# Altium schematic sheet RK3576-SMC.EMMC (0021.0 A0).SchDoc
size 420 x 297 mm; Scale: -; DocumentType: Схема электрическая принципиальная; DocumentGOSTLIt1: ㅤ; DocumentGOSTLIt2: ㅤ; DocumentGOSTLIt3: ㅤ; DocumentGOSTNote: Элементы, отмеченные *, используются при трассировке печатной платы, в состав модуля не включаются; SheetNumber: 4; SheetTotal: 4; DocumentTypeShort: Э3; DocumentInvertoryNumber: ㅤ
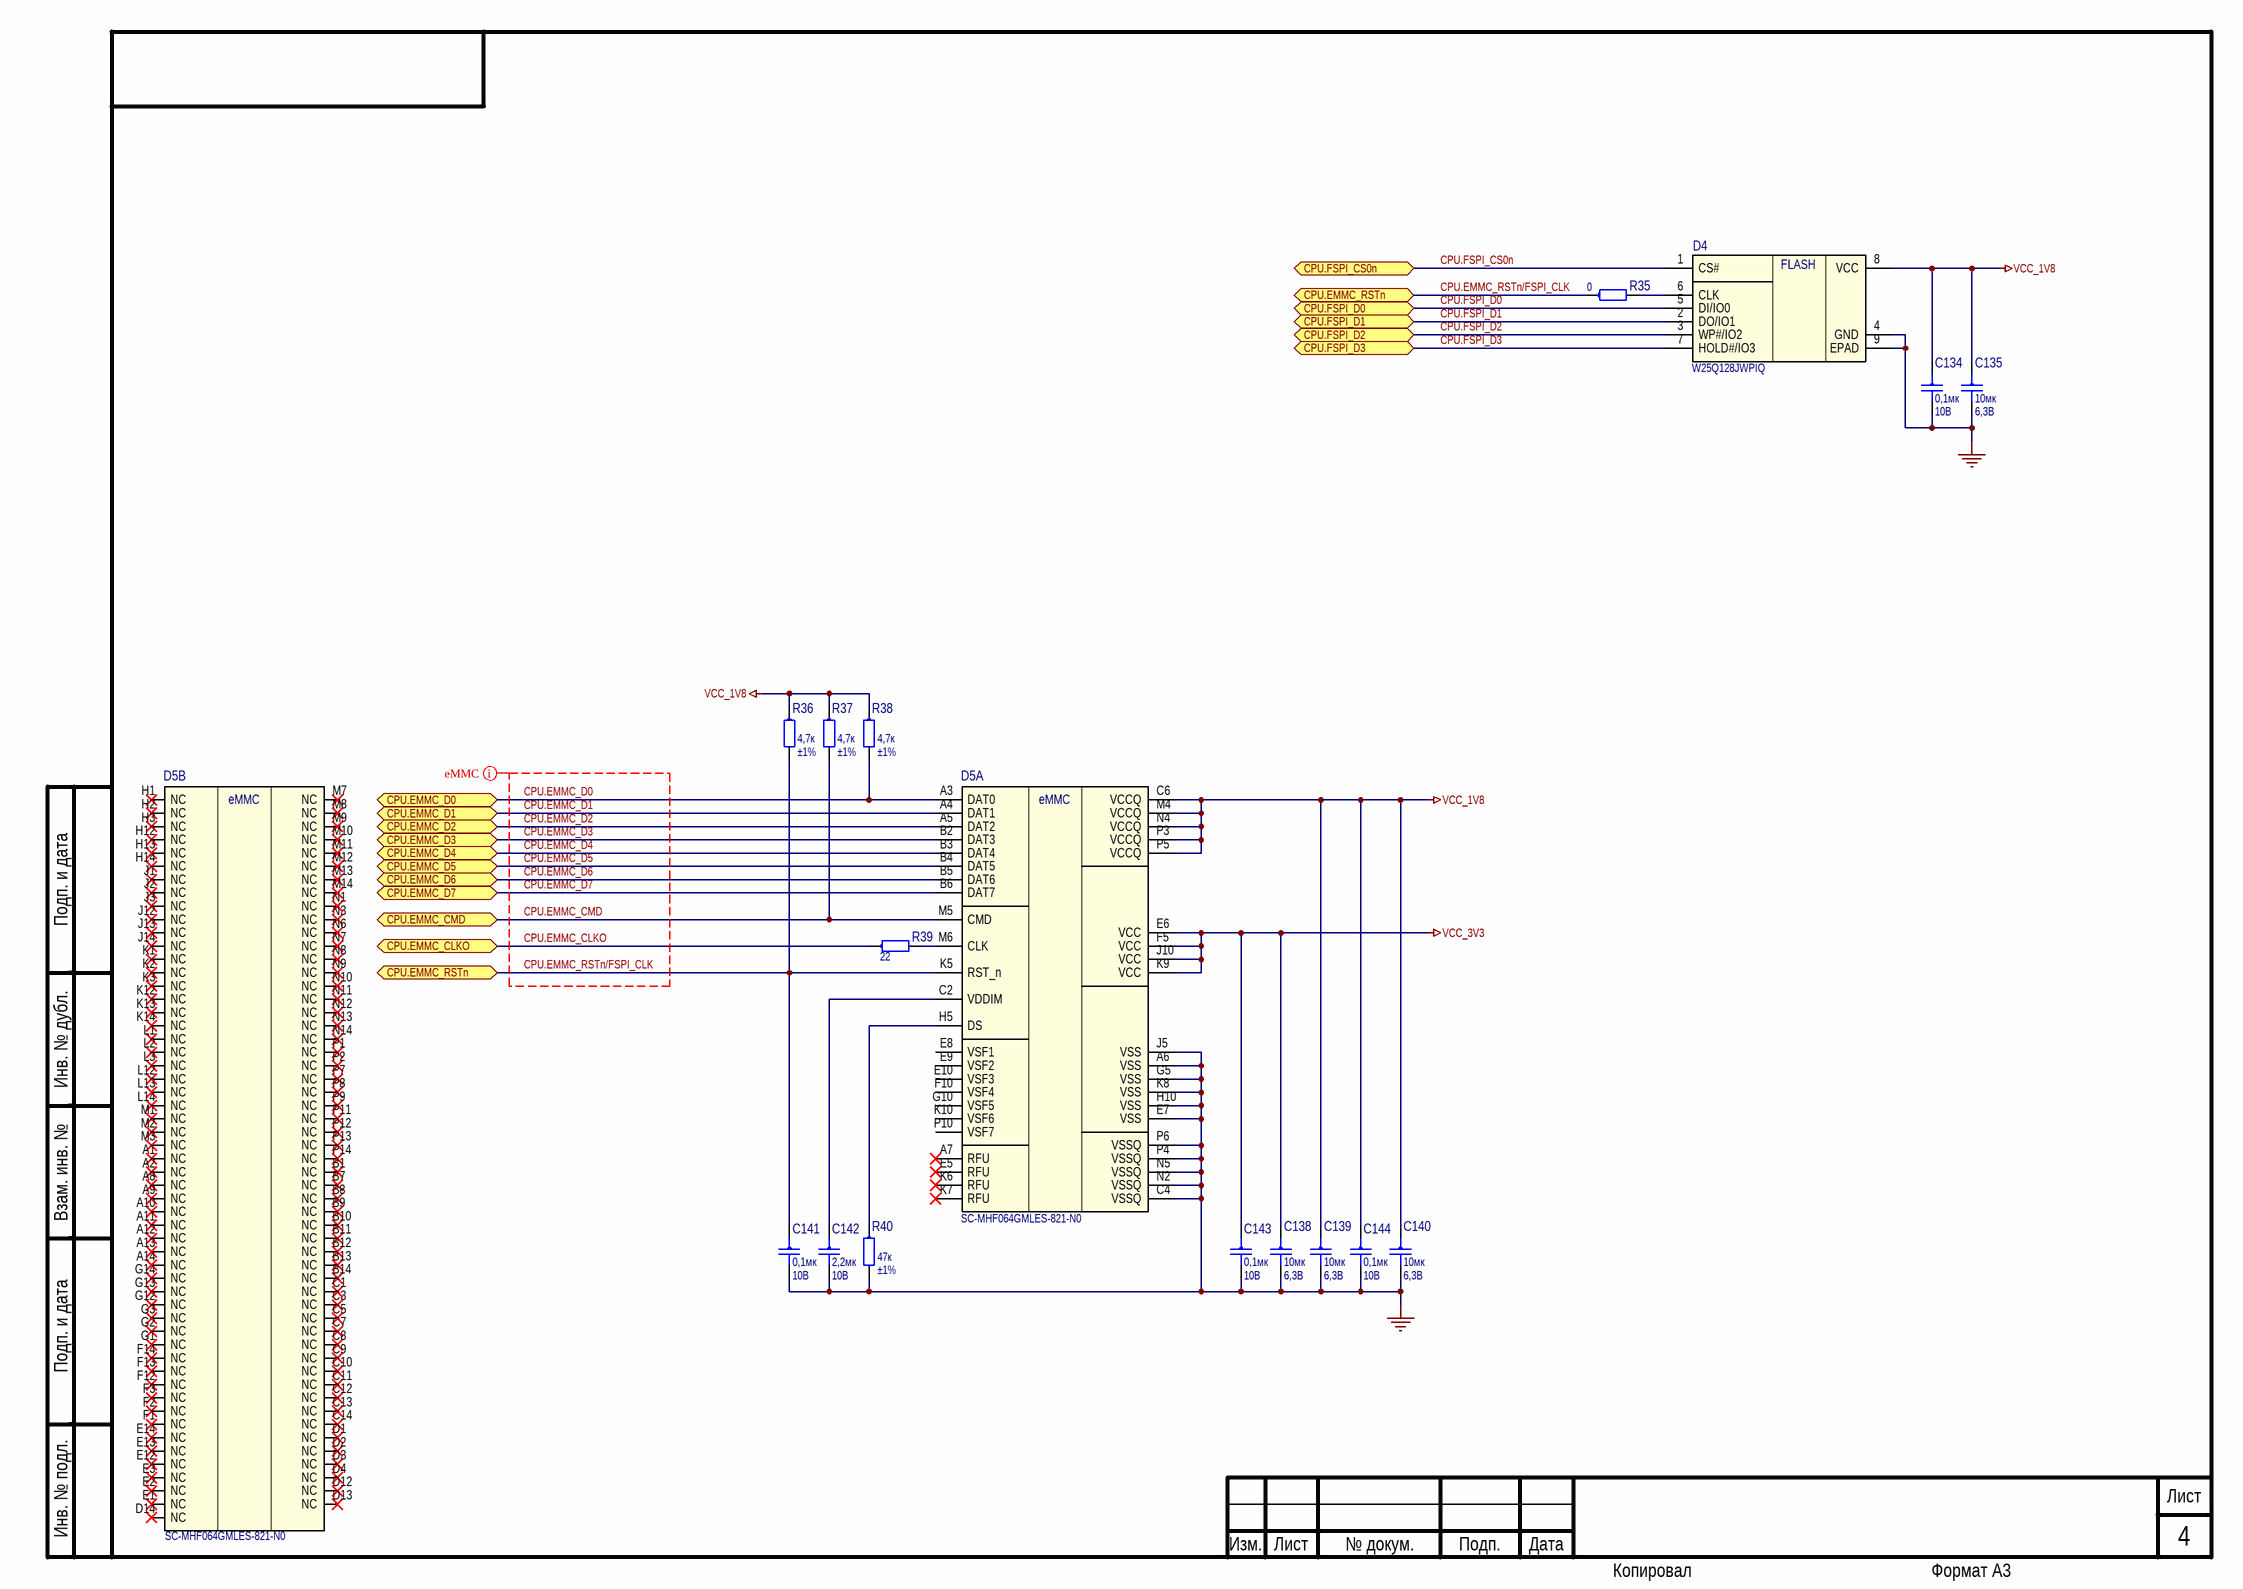
[diagram p0: RK3576-SMC.EMMC (0021.0 A0).SchDoc]

## Parts
C134  0,1мк  Напряжение: 10В  [capc1005x55n]
C135  10мк  Напряжение: 6,3В  [capc1005x70n]
C138  10мк  Напряжение: 6,3В  [capc1005x70n]
C139  10мк  Напряжение: 6,3В  [capc1005x70n]
C140  10мк  Напряжение: 6,3В  [capc1005x70n]
C141  0,1мк  Напряжение: 10В  [capc1005x55n]
C142  2,2мк  Напряжение: 10В  [capc1005x55n]
C143  0,1мк  Напряжение: 10В  [capc1005x55n]
C144  0,1мк  Напряжение: 10В  [capc1005x55n]
D4  W25Q128JWPIQ  [son127p600x500x80-9_hsn_v1]
D5  SC-MHF064GMLES-821-N0  [bga153c50p14x14_1150x1300x100]  (parts A,B of 2)
R35  0  [resc1005x40n]
R36  4,7к  Точность: ±1%  [resc1005x40n]
R37  4,7к  Точность: ±1%  [resc1005x40n]
R38  4,7к  Точность: ±1%  [resc1005x40n]
R39  22  [resc1005x40n]
R40  47к  Точность: ±1%  [resc1005x40n]

## Ports
CPU.EMMC_CLKO (bidir), CPU.EMMC_CMD (bidir), CPU.EMMC_D0 (bidir), CPU.EMMC_D1 (bidir), CPU.EMMC_D2 (bidir), CPU.EMMC_D3 (bidir), CPU.EMMC_D4 (bidir), CPU.EMMC_D5 (bidir), CPU.EMMC_D6 (bidir), CPU.EMMC_D7 (bidir), CPU.EMMC_RSTn (bidir), CPU.FSPI_CS0n (bidir), CPU.FSPI_D0 (bidir), CPU.FSPI_D1 (bidir), CPU.FSPI_D2 (bidir), CPU.FSPI_D3 (bidir)

## Nets
DEV.GND: C134.2 C135.2 C138.2 C139.2 C140.2 C141.2 C142.2 C143.2 C144.2 D4.4(GND) D4.9(EPAD) D5.A6(VSS) D5.C4(VSSQ) D5.E7(VSS) D5.G5(VSS) D5.H10(VSS) D5.J5(VSS) D5.K8(VSS) D5.N2(VSSQ) D5.N5(VSSQ) D5.P4(VSSQ) D5.P6(VSSQ) R40.2
VCC_1V8: C134.1 C135.1 C139.1 C140.1 C144.1 D4.8(VCC) D5.C6(VCCQ) D5.M4(VCCQ) D5.N4(VCCQ) D5.P3(VCCQ) D5.P5(VCCQ) R36.1 R37.1 R38.1
VCC_3V3: C138.1 C143.1 D5.E6(VCC) D5.F5(VCC) D5.J10(VCC) D5.K9(VCC)
CPU.EMMC_CLKO: R39.1 ; port CPU.EMMC_CLKO
CPU.EMMC_CMD: D5.M5(CMD) R37.2 ; port CPU.EMMC_CMD
CPU.EMMC_D0: D5.A3(DAT0) R38.2 ; port CPU.EMMC_D0
CPU.EMMC_D1: D5.A4(DAT1) ; port CPU.EMMC_D1
CPU.EMMC_D2: D5.A5(DAT2) ; port CPU.EMMC_D2
CPU.EMMC_D3: D5.B2(DAT3) ; port CPU.EMMC_D3
CPU.EMMC_D4: D5.B3(DAT4) ; port CPU.EMMC_D4
CPU.EMMC_D5: D5.B4(DAT5) ; port CPU.EMMC_D5
CPU.EMMC_D6: D5.B5(DAT6) ; port CPU.EMMC_D6
CPU.EMMC_D7: D5.B6(DAT7) ; port CPU.EMMC_D7
CPU.EMMC_RSTn/FSPI_CLK: C141.1 D5.K5(RST_n) R35.1 R36.2 ; port CPU.EMMC_RSTn
CPU.FSPI_CS0n: D4.1(CS#) ; port CPU.FSPI_CS0n
CPU.FSPI_D0: D4.5(DI/IO0) ; port CPU.FSPI_D0
CPU.FSPI_D1: D4.2(DO/IO1) ; port CPU.FSPI_D1
CPU.FSPI_D2: D4.3(WP#/IO2) ; port CPU.FSPI_D2
CPU.FSPI_D3: D4.7(HOLD#/IO3) ; port CPU.FSPI_D3
NetC142_1: C142.1 D5.C2(VDDIM)
NetD4_6: D4.6(CLK) R35.2
NetD5_H5: D5.H5(DS) R40.1
NetD5_M6: D5.M6(CLK) R39.2

Not connected (* = marked no-connect by the designer): D5 A1(NC)* A2(NC)* A7(RFU)* A8(NC)* A9(NC)* A10(NC)* A11(NC)* A12(NC)* A13(NC)* A14(NC)* B1(NC)* B7(NC)* B8(NC)* B9(NC)* B10(NC)* B11(NC)* B12(NC)* B13(NC)* B14(NC)* C1(NC)* C3(NC)* C5(NC)* C7(NC)* C8(NC)* C9(NC)* C10(NC)* C11(NC)* C12(NC)* C13(NC)* C14(NC)* D1(NC)* D2(NC)* D3(NC)* D4(NC)* D12(NC)* D13(NC)* D14(NC)* E1(NC)* E2(NC)* E3(NC)* E5(RFU)* E8(VSF1) E9(VSF2) E10(VSF3) E12(NC)* E13(NC)* E14(NC)* F1(NC)* F2(NC)* F3(NC)* F10(VSF4) F12(NC)* F13(NC)* F14(NC)* G1(NC)* G2(NC)* G3(NC)* G10(VSF5) G12(NC)* G13(NC)* G14(NC)* H1(NC)* H2(NC)* H3(NC)* H12(NC)* H13(NC)* H14(NC)* J1(NC)* J2(NC)* J3(NC)* J12(NC)* J13(NC)* J14(NC)* K1(NC)* K2(NC)* K3(NC)* K6(RFU)* K7(RFU)* K10(VSF6) K12(NC)* K13(NC)* K14(NC)* L1(NC)* L2(NC)* L3(NC)* L12(NC)* L13(NC)* L14(NC)* M1(NC)* M2(NC)* M3(NC)* M7(NC)* M8(NC)* M9(NC)* M10(NC)* M11(NC)* M12(NC)* M13(NC)* M14(NC)* N1(NC)* N3(NC)* N6(NC)* N7(NC)* N8(NC)* N9(NC)* N10(NC)* N11(NC)* N12(NC)* N13(NC)* N14(NC)* P1(NC)* P2(NC)* P7(NC)* P8(NC)* P9(NC)* P10(VSF7) P11(NC)* P12(NC)* P13(NC)* P14(NC)*

## Layout directives
net class eMMC; rule Length Constraint [Min Length = 0mm    Max Length = 150mm]; rule Width Constraint [Pref Impedance = 50,00ohms    Min Impedance = 50,00ohms    Max Impedance = 50,00ohms]: CPU.EMMC_CLKO, CPU.EMMC_CMD, CPU.EMMC_D0, CPU.EMMC_D1, CPU.EMMC_D2, CPU.EMMC_D3, CPU.EMMC_D4, CPU.EMMC_D5, CPU.EMMC_D6, CPU.EMMC_D7, CPU.EMMC_RSTn/FSPI_CLK

## Notes on the sheet
- Подп. и дата
- Инв. № дубл.
- Взам. инв. №
- Инв. № подл.
- Изм.
- Лист
- № докум.
- Подп.
- Дата
- Копировал
- Формат А3
- (in symbol W25Q128JWPIQ) FLASH

## Library data of the parts
C134 C141 C143 C144 = C0402C104K8RAC: Part_ID: ATB-04706; Manufacturer: Kemet; Schematic_Part: C_min_val,C_min,C_val,C; Тип ЭКБ: Конденсаторы; Наименование: 0402-X7R-10V-100nF±10%; Тип компонента: Конденсатор керамический; Value: 100nF; Voltage: 10V; Температура: -55 +125; PCB_Footprint: capc1005x55,capc1005x55n; Тип корпуса: Chip; Видоразмер: 1005; Вариант установки: Поверхностный; Photo: Kemet_C0402-C2225.jpg; Автор: Чепиков И.В.; Точность: 10%; Device: 0402-X7R-10V-100nF±10%_Kemet; Library Ref 2: C; Library Ref 3: Cshort; Part Number: C0402C104K8RAC; Datasheet: Kemet_6.3-250V_X7R.pdf; Номинал: 0,1мк; Part_Number: C0402C104K8RAC; Height: 0.55; Производитель: Kemet; Website: https://content.kemet.com/datasheets/KEM_C1002_X7R_SMD.pdf; Дата: 16.10.2024; ComponentLink1Description: Kemet_6.3-250V_X7R.pdf; ComponentLink1URL: https://content.kemet.com/datasheets/KEM_C1002_X7R_SMD.pdf; NameFromManufacturer: C0402C104K8RAC; Original PN: C0402C104K8RAC
C135 C138-C140 = CC0402KRX5R5BB106: Part_ID: ATB-01033; Manufacturer: Yageo; Schematic_Part: C_min_val,C_min,C_val,C; Тип ЭКБ: Конденсаторы; Наименование: 0402-X5R-6.3V-10uF±10%; Тип компонента: Конденсатор керамический; Value: 10uF; Voltage: 6.3V; Температура: -55 +85; PCB_Footprint: capc1005x70,capc1005x70n; Тип корпуса: Chip; Видоразмер: 1005; Вариант установки: Поверхностный; Код ERP: E2-00020067; Photo: Yageo_Capacitors.jpg; Автор: Чепиков И.В.; Точность: 10%; Device: 0402-X5R-6.3V-10uF±10%_Yageo; Library Ref 2: C; Library Ref 3: Cshort; Part Number: CC0402KRX5R5BB106; Datasheet: UPY-GPHC_X5R_4V-to-50V_30.pdf; Номинал: 10мк; Part_Number: CC0402KRX5R5BB106; Height: 0.7; Производитель: Yageo; Website: https://www.yageo.com/upload/media/product/productsearch/datasheet/mlcc/UPY-GPHC_X5R_4V-to-50V_30.pdf; Дата: 25.09.2024; ComponentLink1Description: UPY-GPHC_X5R_4V-to-50V_30.pdf; ComponentLink1URL: https://www.yageo.com/upload/media/product/productsearch/datasheet/mlcc/UPY-GPHC_X5R_4V-to-50V_30.pdf; NameFromManufacturer: CC0402KRX5R5BB106; Original PN: CC0402KRX5R5BB106
C142 = CC0402KRX5R6BB225: Part_ID: ATB-01028; Manufacturer: Yageo; Schematic_Part: C_min_val,C_min,C_val,C; Тип ЭКБ: Конденсаторы; Наименование: 0402-X5R-10V-2.2uF±10%; Тип компонента: Конденсатор керамический; Value: 2.2uF; Voltage: 10V; Температура: -55 +85; PCB_Footprint: capc1005x55,capc1005x55n; Тип корпуса: Chip; Видоразмер: 1005; Вариант установки: Поверхностный; Код ERP: E2-00005144; Photo: Yageo_Capacitors.jpg; Автор: Чепиков И.В.; Точность: 10%; Device: 0402-X5R-10V-2.2uF±10%_Yageo; Library Ref 2: C; Library Ref 3: Cshort; Part Number: CC0402KRX5R6BB225; Datasheet: UPY-GPHC_X5R_4V-to-50V_30.pdf; Номинал: 2,2мк; Part_Number: CC0402KRX5R6BB225; Height: 0.55; Производитель: Yageo; Website: https://www.yageo.com/upload/media/product/productsearch/datasheet/mlcc/UPY-GPHC_X5R_4V-to-50V_30.pdf; Дата: 25.09.2024; ComponentLink1Description: UPY-GPHC_X5R_4V-to-50V_30.pdf; ComponentLink1URL: https://www.yageo.com/upload/media/product/productsearch/datasheet/mlcc/UPY-GPHC_X5R_4V-to-50V_30.pdf; NameFromManufacturer: CC0402KRX5R6BB225; Original PN: CC0402KRX5R6BB225
D4 = W25Q128JWPIQ: Serial Flash Memory With Dual, Quad SPI 1.8V 128M-BIT; Part_ID: ATB-00417; Manufacturer: Winbond; Тип ЭКБ: Микросхемы; Voltage: 1.7 - 1.95; Температура: -40 +85; Тип корпуса: SON6x5-8; Вариант установки: Поверхностный; Код ERP: E2-00012969; Photo: Winbond_W25Q128JWPIQ.jpg; Автор: Чепиков И.В.; Part Number: W25Q128JWPIQ; Наименование: W25Q128JWPIQ; Datasheet: W25Q128JW_RevH.pdf; Тип компонента: Flash; Schematic_Part: W25Q128JWPIQ; Value: W25Q128JWPIQ; Part_Number: W25Q128JWPIQ; PCB_Footprint: son127p600x500x80-9_hsn_v1; Height: 0.8; Производитель: Winbond; Website: https://www.winbond.com/hq/search/newIndex.jsp?q=W25Q128JWPIQ&__locale=en; Дата: 11.07.2024; Device: W25Q128JWPIQ; ComponentLink1Description: W25Q128JW_RevH.pdf; ComponentLink1URL: https://www.winbond.com/hq/search/newIndex.jsp?q=W25Q128JWPIQ&__locale=en; NameFromManufacturer: W25Q128JWPIQ; Original PN: W25Q128JWPIQ
D5 = SC-MHF064GMLES-821-N0: Industrial & Automotive eMMC 5.1 (MEMA series) TLC 64Gb; Part_ID: ATB-00558; Manufacturer: Phison; Тип ЭКБ: Микросхемы; Voltage: 1.8 - 3.3; Температура: -40 +85; Тип корпуса: BGA11.5x13-153; Вариант установки: Поверхностный; Код ERP: E2-00012968; Photo: SanDisk_SDINBDA4-64G.jpg; Автор: Чепиков И.В.; Part Number: SC-MHF064GMLES-821-N0; Наименование: SC-MHF064GMLES-821-N0; Datasheet: SC-MHF064GMLES.pdf; Тип компонента: eMMC; Schematic_Part: MTFC64GAPALBH-AIT; Value: SC-MHF064GMLES-821-N0; Part_Number: SC-MHF064GMLES-821-N0; PCB_Footprint: bga153c50p14x14_1150x1300x100; Height: 1; Weight: 0.3; Производитель: Phison; Дата: 28.08.2024; Device: SC-MHF064GMLES-821-N0; ComponentLink1Description: SC-MHF064GMLES.pdf; NameFromManufacturer: SC-MHF064GMLES-821-N0; Original PN: SC-MHF064GMLES-821-N0
R35 = RC0402JR-070RL: Part_ID: ATB-00732; Manufacturer: Yageo; Schematic_Part: R_min_val,R_min,R_val,R; Тип ЭКБ: Резисторы; Наименование: 0402-0.063W-0±5%; Тип компонента: Резистор; Voltage: 50V; Power: 0.063; Точность: ±5%; Температура: -55 +155; Тип корпуса: Chip; Вариант установки: Поверхностный; Код ERP: E2-00036287; Photo: Yageo_RC0075-RC2512.jpg; Автор: Чепиков И.В.; Device: 0402-0.063W-0±5%_Yageo; Library Ref 2: R; Part Number: RC0402JR-070RL; Datasheet: PYu-RC_Group_51_RoHS_L_12.pdf; Номинал: 0; Value: 0; Part_Number: RC0402JR-070RL; PCB_Footprint: resc1005x40n; Height: 0.4; Производитель: Yageo; Website: https://www.yageo.com/upload/media/product/products/datasheet/rchip/PYu-RC_Group_51_RoHS_L_12.pdf; Дата: 25.09.2024; NameFromManufacturer: RC0402JR-070RL; ComponentLink1URL: https://www.yageo.com/upload/media/product/products/datasheet/rchip/PYu-RC_Group_51_RoHS_L_12.pdf; ComponentLink1Description: PYu-RC_Group_51_RoHS_L_12.pdf; Original PN: RC0402JR-070RL
R36-R38 = RC0402FR-074K7L: Part_ID: ATB-00516; Manufacturer: Yageo; Schematic_Part: R_min_val,R_min,R_val,R; Тип ЭКБ: Резисторы; Наименование: 0402-0.063W-4.7K-100ppm±1%; Тип компонента: Резистор; Value: 4.7k; Voltage: 50V; Power: 0.063; ТКС (от  -60 до +20 град): ± 100; Ряд: E24; Температура: -55 +155; Тип корпуса: Chip; Вариант установки: Поверхностный; Код ERP: E2-00028493; Photo: Yageo_RC0075-RC2512.jpg; Автор: Чепиков И.В.; Device: 0402-0.063W-4.7K-100ppm±1%_Yageo; Library Ref 2: R; Part Number: RC0402FR-074K7L; Datasheet: PYu-RC_Group_51_RoHS_L_12.pdf; Номинал: 4,7к; ТКС (от +20 град до max): ± 100; Part_Number: RC0402FR-074K7L; PCB_Footprint: resc1005x40n; Height: 0.4; Производитель: Yageo; Website: https://www.yageo.com/upload/media/product/products/datasheet/rchip/PYu-RC_Group_51_RoHS_L_12.pdf; Дата: 23.08.2024; NameFromManufacturer: RC0402FR-074K7L; ComponentLink1URL: https://www.yageo.com/upload/media/product/products/datasheet/rchip/PYu-RC_Group_51_RoHS_L_12.pdf; ComponentLink1Description: PYu-RC_Group_51_RoHS_L_12.pdf; Original PN: RC0402FR-074K7L
R39 = RC0402FR-0722RL: Part_ID: ATB-00511; Manufacturer: Yageo; Schematic_Part: R_min_val,R_min,R_val,R; Тип ЭКБ: Резисторы; Наименование: 0402-0.063W-22R-100ppm±1%; Тип компонента: Резистор; Voltage: 50V; Power: 0.063; Точность: ±1%; ТКС (от  -60 до +20 град): ± 100; Ряд: E24; Температура: -55 +155; Тип корпуса: Chip; Вариант установки: Поверхностный; Код ERP: E2-00028484; Photo: Yageo_RC0075-RC2512.jpg; Автор: Чепиков И.В.; Device: 0402-0.063W-22R-100ppm±1%_Yageo; Library Ref 2: R; Part Number: RC0402FR-0722RL; Datasheet: PYu-RC_Group_51_RoHS_L_12.pdf; Номинал: 22; Value: 22; ТКС (от +20 град до max): ± 100; Part_Number: RC0402FR-0722RL; PCB_Footprint: resc1005x40n; Height: 0.4; Производитель: Yageo; Website: https://www.yageo.com/upload/media/product/products/datasheet/rchip/PYu-RC_Group_51_RoHS_L_12.pdf; Дата: 23.08.2024; NameFromManufacturer: RC0402FR-0722RL; ComponentLink1URL: https://www.yageo.com/upload/media/product/products/datasheet/rchip/PYu-RC_Group_51_RoHS_L_12.pdf; ComponentLink1Description: PYu-RC_Group_51_RoHS_L_12.pdf; Original PN: RC0402FR-0722RL
R40 = RC0402FR-0747KL: Part_ID: ATB-00827; Manufacturer: Yageo; Schematic_Part: R_min_val,R_min,R_val,R; Тип ЭКБ: Резисторы; Наименование: 0402-0.063W-47K-100ppm±1%; Тип компонента: Резистор; Value: 47k; Voltage: 50V; Power: 0.063; ТКС (от  -60 до +20 град): ± 100; Ряд: E24; Температура: -55 +155; Тип корпуса: Chip; Вариант установки: Поверхностный; Код ERP: E2-00028165; Photo: Yageo_RC0075-RC2512.jpg; Автор: Чепиков И.В.; Device: 0402-0.063W-47K-100ppm±1%_Yageo; Library Ref 2: R; Part Number: RC0402FR-0747KL; Datasheet: PYu-RC_Group_51_RoHS_L_12.pdf; Номинал: 47к; ТКС (от +20 град до max): ± 100; Part_Number: RC0402FR-0747KL; PCB_Footprint: resc1005x40n; Height: 0.4; Производитель: Yageo; Website: https://www.yageo.com/upload/media/product/products/datasheet/rchip/PYu-RC_Group_51_RoHS_L_12.pdf; Дата: 25.09.2024; NameFromManufacturer: RC0402FR-0747KL; ComponentLink1URL: https://www.yageo.com/upload/media/product/products/datasheet/rchip/PYu-RC_Group_51_RoHS_L_12.pdf; ComponentLink1Description: PYu-RC_Group_51_RoHS_L_12.pdf; Original PN: RC0402FR-0747KL